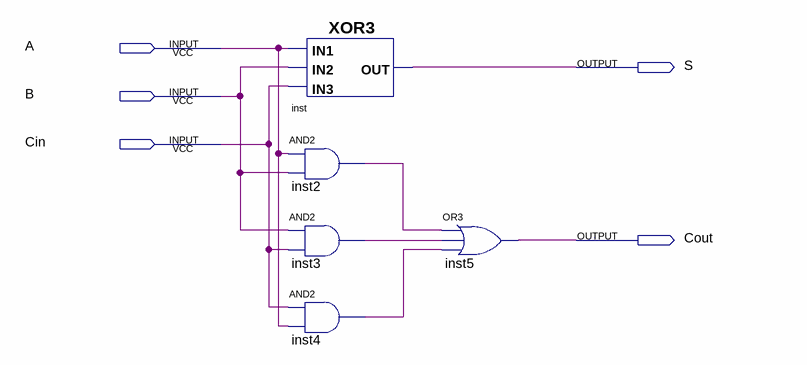
[diagram p0: schematic sheet]
// Quartus schematic somador.bdf as structural Verilog: 5 symbols, 5 pins
module somador (
  input  A,
  input  B,
  input  Cin,
  output S,
  output Cout
);

  wire inst2_out, inst3_out, inst4_out;

  XOR3 inst (.IN3(Cin), .IN1(A), .IN2(B), .OUT(S));
  and inst2 (inst2_out, A, B);
  and inst3 (inst3_out, B, Cin);
  and inst4 (inst4_out, Cin, A);
  or inst5 (Cout, inst2_out, inst3_out, inst4_out);
endmodule
